# Altium schematic sheet MCU.SchDoc
size A4
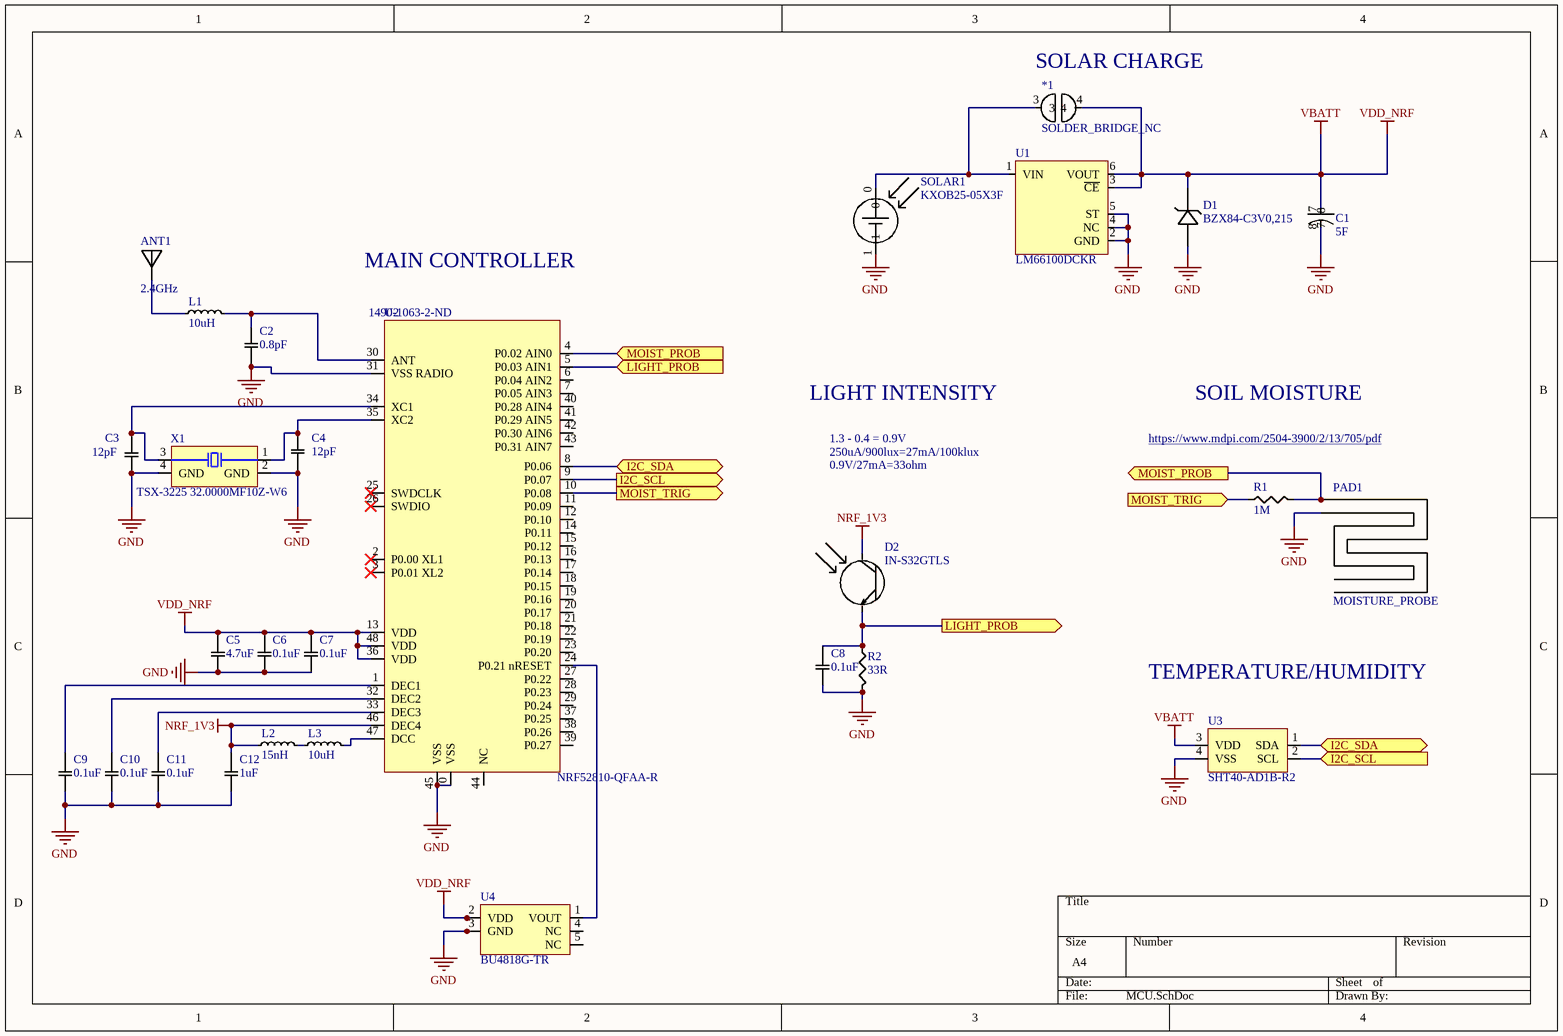
[diagram p0: MCU.SchDoc]

## Parts
*1  SOLDER_BRIDGE_NC
ANT1  2.4GHz
C1  5F
C2  0.8pF
C3  12pF
C4  12pF
C5  4.7uF
C6  0.1uF
C7  0.1uF
C8  0.1uF
C9  0.1uF
C10  0.1uF
C11  0.1uF
C12  1uF
D1  BZX84-C3V0,215
D2  IN-S32GTLS
L1  10uH
L2  15nH
L3  10uH
PAD1  MOISTURE_PROBE
R1  1M
R2  33R
SOLAR1  KXOB25-05X3F
U1  LM66100DCKR
U2  NRF52810-QFAA-R  Supplier Part Number 1: 1490-1063-2-ND
U3  SHT40-AD1B-R2
U4  BU4818G-TR
X1  TSX-3225 32.0000MF10Z-W6

## Ports
I2C_SCL (in), I2C_SCL (out), I2C_SDA (bidir), LIGHT_PROB (in), LIGHT_PROB (out), MOIST_PROB (in), MOIST_PROB (out), MOIST_TRIG (in), MOIST_TRIG (out)

## Nets
GND: C1.8 C2.1 C3.2 C4.1 C5.2 C6.2 C7.2 C8.2 C9.2 C10.2 C11.2 C12.2 D1.A PAD1.?1 R2.2 SOLAR1.1 U1.2(GND) U1.4(NC) U1.5(ST) U2.0(VSS) U2.31(VSS_RADIO) U2.45(VSS) U3.4(VSS) U4.3(GND) X1.2(GND) X1.4(GND)
NRF_1V3: C12.1 D2.1 L2.1 U2.46(DEC4)
VBATT: *1.4 C1.7 C5.1 C6.1 C7.1 D1.C U1.3(~{CE}) U1.6(VOUT) U2.13(VDD) U2.36(VDD) U2.48(VDD) U3.3(VDD) U4.2(VDD)  [also labelled VDD_NRF]
I2C_SCL: U2.9(P0.07) U3.2(SCL) ; port I2C_SCL
I2C_SDA: U2.8(P0.06) U3.1(SDA) ; port I2C_SDA
LIGHT_PROB: C8.1 D2.0 R2.1 U2.5(P0.03_AIN1) ; port LIGHT_PROB
MOIST_PROB: PAD1.?2 R1.2 U2.4(P0.02_AIN0) ; port MOIST_PROB
MOIST_TRIG: R1.1 U2.10(P0.08) ; port MOIST_TRIG
Net*1_3: *1.3 SOLAR1.0 U1.1(VIN)
NetANT1_1: ANT1.1 L1.1
NetC2_2: C2.2 L1.2 U2.30(ANT)
NetC3_1: C3.1 U2.34(XC1) X1.3
NetC4_2: C4.2 U2.35(XC2) X1.1
NetC9_1: C9.1 U2.1(DEC1)
NetC10_1: C10.1 U2.32(DEC2)
NetC11_1: C11.1 U2.33(DEC3)
NetL2_2: L2.2 L3.1
NetL3_2: L3.2 U2.47(DCC)
NetU2_24: U2.24(P0.21_nRESET) U4.1(VOUT)

Not connected (* = marked no-connect by the designer): U2 2(P0.00_XL1)* 3(P0.01_XL2)* 6(P0.04_AIN2) 7(P0.05_AIN3) 11(P0.09) 12(P0.10) 14(P0.11) 15(P0.12) 16(P0.13) 17(P0.14) 18(P0.15) 19(P0.16) 20(P0.17) 21(P0.18) 22(P0.19) 23(P0.20) 25(SWDCLK)* 26(SWDIO)* 27(P0.22) 28(P0.23) 29(P0.24) 37(P0.25) 38(P0.26) 39(P0.27) 40(P0.28_AIN4) 41(P0.29_AIN5) 42(P0.30_AIN6) 43(P0.31_AIN7) 44(NC); U4 4(NC) 5(NC)

## Notes on the sheet
- (near *1) SOLAR CHARGE
- MAIN CONTROLLER
- LIGHT INTENSITY
- 1.3 - 0.4 = 0.9V
- https://www.mdpi.com/2504-3900/2/13/705/pdf
- SOIL MOISTURE
- 250uA/900lux=27mA/100klux
- 0.9V/27mA=33ohm
- TEMPERATURE/HUMIDITY

## Library data of the parts
ANT1 = 2119640001: 2.4GHz chip antenna
C1 = DSF505Q3R0: 5F 3V supercap
C2 = CBR06C808B5GAC: 0.8pF RF capacitor
C3 C4 = 0603N120J500CT: 12pF NP0 0603 Capacitor
C5 = CL10B475KQ8NQNC: 4.7uF 0603 6.3V
C6-C11 = 0805B104K250CT: 0.1uF X7R 0805 Capacitor
C12 = CL21B105KOFNNNG
D2 = IN-S32GTLS: Ambient light sensor
L1 L3 = LQM18FN100M00D: 10uH chip inductor
L2 = BSCH0016080815NJ00: 15nH chip inductor
R1 = RMCF0603FG1M00: 1Mohm
R2 = RMCF0603JT33R0: 33ohm
SOLAR1 = KXOB25-05X3F: 30.7mW 19.5mA 2.07V
U1 = LM66100DCKR: Ideal diode
U4 = BU4818G-TR: 1.8V low voltage cutoff
U2 = NRF52810-QFAA-R: Supplier 1: Digi-Key